# Altium schematic sheet VCONV-DAC.SchDoc
size A4; SheetNumber: 3; SheetTotal: 5
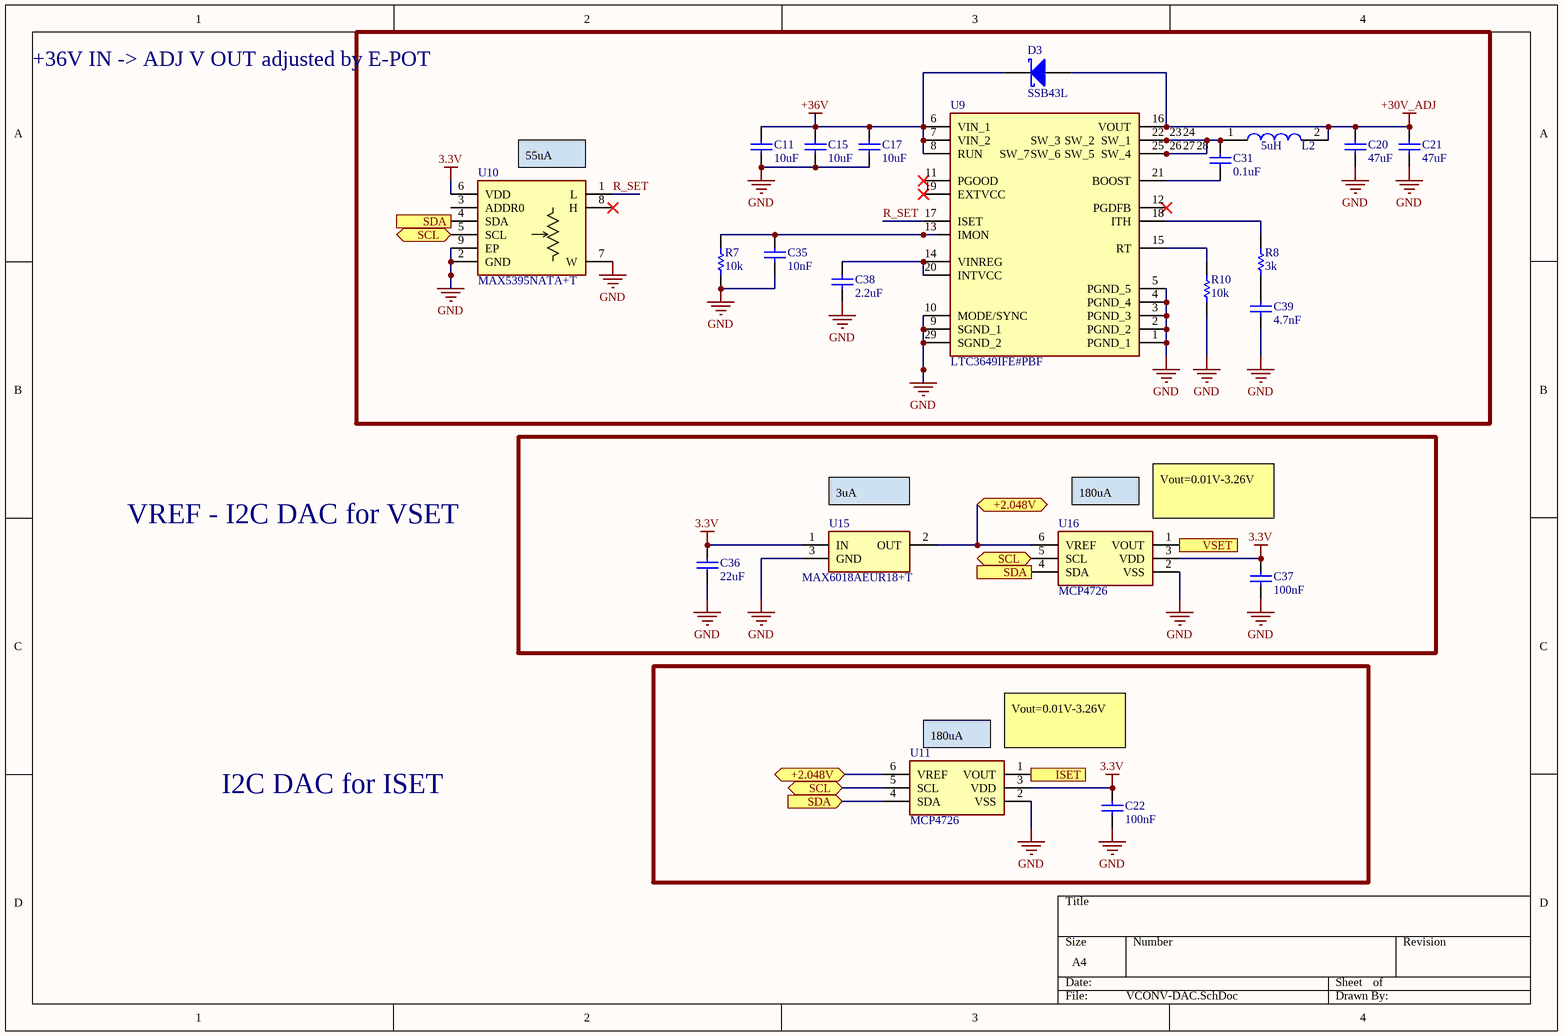
[diagram p0: VCONV-DAC.SchDoc]

## Parts
C11  value 10uF  [Cap_0603]  (hidden comment: Cap)
C15  value 10uF  [Cap_0603]  (hidden comment: Cap)
C17  value 10uF  [Cap_0603]  (hidden comment: Cap)
C20  value 47uF  [Cap_0603]  (hidden comment: Cap)
C21  value 47uF  [Cap_0603]  (hidden comment: Cap)
C22  value 100nF  [Cap_0603]  (hidden comment: Cap)
C31  value 0.1uF  [Cap_0603]  (hidden comment: Cap)
C35  value 10nF  [Cap_0603]  (hidden comment: Cap)
C36  value 22uF  [Cap_0603]  (hidden comment: Cap)
C37  value 100nF  [Cap_0603]  (hidden comment: Cap)
C38  value 2.2uF  [Cap_0603]  (hidden comment: Cap)
C39  value 4.7nF  [Cap_0603]  (hidden comment: Cap)
D3  SSB43L  [DO-214AA(SMB)]
L2  5uH  [IND_TCK-141_TRP]
R7  value 10k  [RES_0805]  (hidden comment: Res1)
R8  value 3k  [RES_0805]  (hidden comment: Res1)
R10  value 10k  [RES_0805]  (hidden comment: Res1)
U9  LTC3649IFE#PBF  [SOP65P640X120-29N]
U10  MAX5395NATA+T  [SON50P200X200X80-9N-D]
U11  MCP4726  [SOT95P270X145-6N]
U15  MAX6018AEUR18+T  [SOT95P237X112-3N]
U16  MCP4726  [SOT95P270X145-6N]

## Ports
+2.048V (bidir), ISET (out), SCL (bidir), SDA (in), VSET (out)

## Nets
3.3V: C22.1 C36.1 C37.1 U10.6(VDD) U11.3(VDD) U15.1(IN) U16.3(VDD)
+30V_ADJ: C20.1 C21.1 D3.A L2.2 U9.16(VOUT)
+36V: C11.1 C15.1 C17.1 D3.K U9.6(VIN_1) U9.7(VIN_2) U9.8(RUN)
GND: C11.2 C15.2 C17.2 C20.2 C21.2 C22.2 C35.2 C36.2 C37.2 C38.2 C39.2 R7.1 R10.1 U9.1(PGND_1) U9.2(PGND_2) U9.3(PGND_3) U9.4(PGND_4) U9.5(PGND_5) U9.9(SGND_1) U9.10(MODE/SYNC) U9.29(SGND_2) U10.2(GND) U10.7(W) U10.9(EP) U11.2(VSS) U15.3(GND) U16.2(VSS)
+2.048V: U11.6(VREF) U15.2(OUT) U16.6(VREF) ; port +2.048V
ISET: U11.1(VOUT) ; port ISET
R_SET: U9.17(ISET) U10.1(L)
SCL: U10.5(SCL) U11.5(SCL) U16.5(SCL) ; port SCL
SDA: U10.4(SDA) U11.4(SDA) U16.4(SDA) ; port SDA
VSET: U16.1(VOUT) ; port VSET
NetC31_1: C31.1 L2.1 U9.22(SW_1) U9.23(SW_2) U9.24(SW_3) U9.25(SW_4) U9.26(SW_5) U9.27(SW_6) U9.28(SW_7)
NetC31_2: C31.2 U9.21(BOOST)
NetC35_1: C35.1 R7.2 U9.13(IMON)
NetC38_1: C38.1 U9.14(VINREG) U9.20(INTVCC)
NetC39_1: C39.1 R8.1
NetR8_2: R8.2 U9.18(ITH)
NetR10_2: R10.2 U9.15(RT)

Not connected (* = marked no-connect by the designer): U9 11(PGOOD)* 12(PGDFB)* 19(EXTVCC)*; U10 3(ADDR0) 8(H)*

## Notes on the sheet
- +36V IN -> ADJ V OUT adjusted by E-POT
- (near U10) 55uA
- (near U15) 3uA
- (near U16) 180uA
- (near U16) Vout=0.01V-3.26V
- VREF - I2C DAC for VSET
- (near U11) 180uA
- (near U11) Vout=0.01V-3.26V
- I2C DAC for ISET

## Library data of the parts
C11 C15 C17 C20-C22 C31 C35-C39 = Cap: Capacitor; Published: 8-Jun-2000; LatestRevisionDate: 17-Jul-2002; LatestRevisionNote: Re-released for DXP Platform.; PackageReference: RAD-0.3; Publisher: Altium Limited; PackageDescription: Radial Cap, Thru-Hole; 2 Leads; 0.3 in Pin Spacing
D3 = SSB43L: Schottky Rectifier, 40 V, 4 A, Single, DO-214AA (SMB), 2 Pins, 490 mV; Supplier 1: Farnell; Supplier Part Number 1: 1336556; ComponentLink1Description: Datasheet; ComponentLink1URL: https://4donline.ihs.com/images/VipMasterIC/IC/VISH/VISH-S-A0010452954/VISH-S-A0010476709-1.pdf?hkey=6D3A4C79FDBF58556ACFDE234799DDF0
L2 = TCK-141: FIXED IND 5.6UH 3.5A 90MOHM SMD; Mfr_Name: Traco Power; Type: DEV; Copyright: Copyright (C) 2023 Ultra Librarian. All rights reserved.; Manufacturer_Part_Number: TCK-141; RefDes: RefDes; ComponentLink1Description: Datasheet; ComponentLink1URL: https://www.tracopower.com/products/tck141.pdf
R7 R8 R10 = Res1: Resistor; Published: 8-Jun-2000; LatestRevisionDate: 17-Jul-2002; LatestRevisionNote: Re-released for DXP Platform.; PackageReference: AXIAL-0.3; Publisher: Altium Limited; PackageDescription: Axial Device, Thru-Hole; 2 Leads; 0.3 in Pin Spacing
U9 = LTC3649IFE#PBF: 60V, 4A Synchronous Step-Down Regulator with Rail-to-Rail Programmable Output; Manufacturer_Name: Analog Devices; Geometry.Height: 1.2mm; Manufacturer_Part_Number: LTC3649IFE#PBF; Mouser Part Number: 584-LTC3649IFE#PBF; Mouser Price/Stock: https://www.mouser.co.uk/ProductDetail/Analog-Devices/LTC3649IFEPBF?qs=oahfZPh6IALghjzowGYuFA%3D%3D; Arrow Part Number: LTC3649IFE#PBF; Arrow Price/Stock: https://www.arrow.com/en/products/ltc3649ifepbf/linear-technology; Datasheet Link: http://www.analog.com/media/en/technical-documentation/data-sheets/3649fb.pdf; Supplier 1: Digi-Key; Supplier Part Number 1: LTC3649IFE#PBF-ND; ComponentLink1Description: Datasheet; ComponentLink1URL: https://www.analog.com/media/en/technical-documentation/data-sheets/3649fb.pdf
U10 = MAX5395NATA+T: ingle, 256-Tap Volatile, I2C, Low-Voltage Linear / Taper Digital Potentiometer; Manufacturer_Name: Analog Devices; Datasheet Link: https://datasheets.maximintegrated.com/en/ds/MAX5395.pdf; Height: 0.8mm; Manufacturer_Part_Number: MAX5395NATA+T; Mouser Part Number: 700-MAX5395NATA+T; Mouser Price/Stock: https://www.mouser.co.uk/ProductDetail/Analog-Devices-Maxim-Integrated/MAX5395NATA%2bT?qs=0JU57JYmZjt6U4d8%252BEwekw%3D%3D; ComponentLink1Description: Datasheet; ComponentLink1URL: https://www.farnell.com/datasheets/2297485.pdf
U11 U16 = MCP4725A0T-E_CH: 12-Bit Digital-to-Analog Converter with EEPROM Memory; Manufacturer_Name: Microchip; Manufacturer_Part_Number: MCP4725A0T-E/CH; Datasheet Link: http://ww1.microchip.com/downloads/en/DeviceDoc/22039d.pdf; Height: 1.45mm; Mouser Part Number: 579-MCP4725A0TECH; Mouser Price/Stock: https://www.mouser.co.uk/ProductDetail/Microchip-Technology/MCP4725A0T-E-CH?qs=vkMqrgFpRajeQECZ3goc0A%3D%3D; Arrow Part Number: MCP4725A0T-E/CH; Arrow Price/Stock: https://www.arrow.com/en/products/mcp4725a0t-ech/microchip-technology?region=nac; ComponentLink1Description: Datasheet; ComponentLink1URL: http://ww1.microchip.com/downloads/en/DeviceDoc/22039d.pdf
U15 = MAX6018AEUR18+T: Precision, Micropower, 1.8V Supply, / Low-Dropout, SOT23 Voltage Reference; Manufacturer_Name: Analog Devices; Datasheet Link: https://datasheets.maximintegrated.com/en/ds/MAX6018-MAX6018B.pdf; Height: 1.12mm; Manufacturer_Part_Number: MAX6018AEUR18+T; Mouser Part Number: 700-MAX6018AEUR18T; Mouser Price/Stock: https://www.mouser.co.uk/ProductDetail/Maxim-Integrated/MAX6018AEUR18%2bT?qs=GxOUx7aO6nxTHpj7gtPQaw%3D%3D; ComponentLink1Description: Datasheet; ComponentLink1URL: https://datasheets.maximintegrated.com/en/ds/MAX6018-MAX6018B.pdf